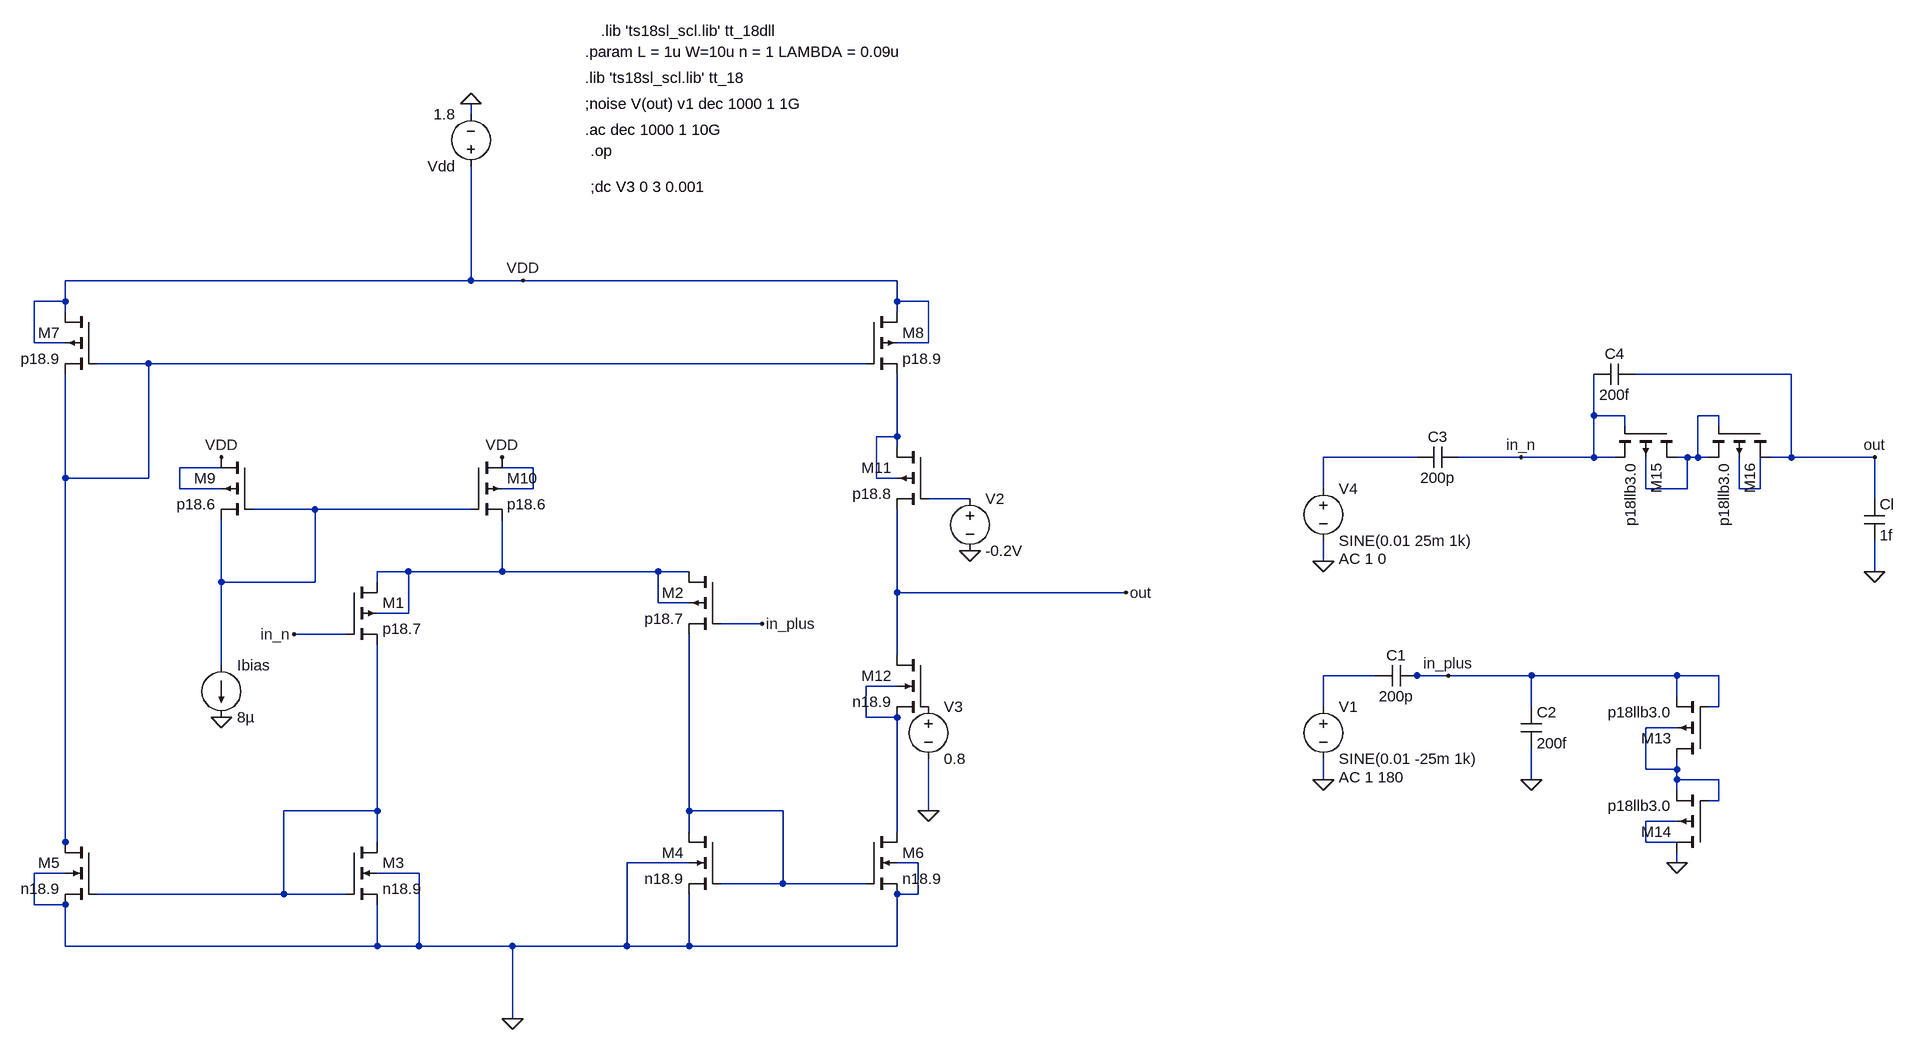
[diagram p0: schematic neural.asc]
neural.asc, the LTspice schematic file:
Version 4
SHEET 1 3032 1344
WIRE 432 -176 432 -192
WIRE 432 80 432 -96
WIRE 432 80 -192 80
WIRE 512 80 432 80
WIRE 1088 80 512 80
WIRE -192 112 -192 80
WIRE -192 112 -240 112
WIRE 1088 112 1088 80
WIRE 1136 112 1088 112
WIRE -192 128 -192 112
WIRE 1088 128 1088 112
WIRE -240 176 -240 112
WIRE -192 176 -240 176
WIRE 1136 176 1136 112
WIRE 1136 176 1088 176
WIRE -64 208 -144 208
WIRE 1040 208 -64 208
WIRE 2464 224 2224 224
WIRE 2160 288 2160 224
WIRE 2208 288 2160 288
WIRE 2352 288 2320 288
WIRE 2208 304 2208 288
WIRE 2352 304 2352 288
WIRE 1088 320 1088 224
WIRE 1088 320 1056 320
WIRE 1088 336 1088 320
WIRE 1888 352 1744 352
WIRE 2048 352 1952 352
WIRE 2160 352 2160 288
WIRE 2160 352 2048 352
WIRE 2192 352 2160 352
WIRE 2304 352 2288 352
WIRE 2320 352 2320 288
WIRE 2320 352 2304 352
WIRE 2336 352 2320 352
WIRE 2464 352 2464 224
WIRE 2464 352 2432 352
WIRE 2592 352 2464 352
WIRE 48 368 -16 368
WIRE 528 368 480 368
WIRE -192 384 -192 224
WIRE -64 384 -64 208
WIRE -64 384 -192 384
WIRE 1056 384 1056 320
WIRE 1088 384 1056 384
WIRE -16 400 -16 368
WIRE 48 400 -16 400
WIRE 528 400 528 368
WIRE 528 400 480 400
WIRE 1744 400 1744 352
WIRE 2240 400 2240 352
WIRE 2304 400 2304 352
WIRE 2304 400 2240 400
WIRE 2384 400 2384 352
WIRE 2416 400 2416 352
WIRE 2416 400 2384 400
WIRE 1200 416 1136 416
WIRE 2592 416 2592 352
WIRE 192 432 96 432
WIRE 432 432 192 432
WIRE 1744 512 1744 480
WIRE 336 528 288 528
WIRE 480 528 480 448
WIRE 480 528 336 528
WIRE 720 528 480 528
WIRE 768 528 720 528
WIRE 2592 528 2592 480
WIRE 48 544 48 448
WIRE 192 544 192 432
WIRE 192 544 48 544
WIRE 288 544 288 528
WIRE 1088 560 1088 432
WIRE 1440 560 1088 560
WIRE 720 576 720 528
WIRE 768 576 720 576
WIRE 336 592 336 528
WIRE 336 592 288 592
WIRE 880 608 816 608
WIRE 240 624 160 624
WIRE 1088 656 1088 560
WIRE 48 672 48 544
WIRE 1824 688 1744 688
WIRE 1888 688 1872 688
WIRE 1936 688 1888 688
WIRE 2064 688 1936 688
WIRE 2288 688 2064 688
WIRE 2352 688 2288 688
WIRE 1088 704 1040 704
WIRE 2288 720 2288 688
WIRE 1744 736 1744 688
WIRE 2064 736 2064 688
WIRE 2352 736 2352 688
WIRE 2352 736 2336 736
WIRE 1040 752 1040 704
WIRE 1088 752 1040 752
WIRE 2288 768 2240 768
WIRE 2240 832 2240 768
WIRE 2288 832 2288 816
WIRE 2288 832 2240 832
WIRE 1744 848 1744 816
WIRE 2064 848 2064 800
WIRE 2288 848 2288 832
WIRE 2352 848 2288 848
WIRE 2288 864 2288 848
WIRE 2352 880 2352 848
WIRE 2352 880 2336 880
WIRE 288 896 288 640
WIRE 288 896 144 896
WIRE 768 896 768 624
WIRE 912 896 768 896
WIRE 1136 896 1136 816
WIRE 2288 912 2240 912
WIRE 768 928 768 896
WIRE 1088 928 1088 752
WIRE -192 944 -192 384
WIRE 288 944 288 896
WIRE 2240 944 2240 912
WIRE 2288 944 2240 944
WIRE -192 960 -192 944
WIRE 768 976 672 976
WIRE 1120 976 1088 976
WIRE 2288 976 2288 960
WIRE -192 992 -240 992
WIRE 352 992 288 992
WIRE 912 1008 912 896
WIRE 912 1008 816 1008
WIRE 1040 1008 912 1008
WIRE 144 1024 144 896
WIRE 144 1024 -144 1024
WIRE 240 1024 144 1024
WIRE 1120 1024 1120 976
WIRE 1120 1024 1088 1024
WIRE -240 1040 -240 992
WIRE -192 1040 -240 1040
WIRE -192 1104 -192 1040
WIRE 288 1104 288 1040
WIRE 288 1104 -192 1104
WIRE 352 1104 352 992
WIRE 352 1104 288 1104
WIRE 496 1104 352 1104
WIRE 672 1104 672 976
WIRE 672 1104 496 1104
WIRE 768 1104 768 1024
WIRE 768 1104 672 1104
WIRE 1088 1104 1088 1024
WIRE 1088 1104 768 1104
WIRE 496 1216 496 1104
FLAG 48 752 0
FLAG 1440 560 out
FLAG 1744 848 0
FLAG 880 608 in_plus
FLAG 1136 896 0
FLAG 1200 496 0
FLAG 496 1216 0
FLAG 512 80 VDD
FLAG 48 352 VDD
FLAG 432 -192 0
FLAG 1744 512 0
FLAG 160 624 in_n
FLAG 2064 848 0
FLAG 2592 528 0
FLAG 2288 976 0
FLAG 480 352 VDD
FLAG 1936 688 in_plus
FLAG 2048 352 in_n
FLAG 2592 352 out
DATAFLAG -192 384 ""
DATAFLAG 512 528 ""
DATAFLAG 912 1008 ""
DATAFLAG 256 1104 ""
DATAFLAG 224 896 ""
DATAFLAG 1088 816 ""
DATAFLAG 1088 528 ""
DATAFLAG 1088 288 ""
SYMBOL nmos4 816 928 M0
SYMATTR InstName M4
SYMATTR Value n18.9
SYMATTR Value2 l=3u w=20u ad={5*W*LAMBDA} as={5*W*LAMBDA} pd={10*LAMBDA+2*W} ps={10*LAMBDA+2*W}
SYMBOL voltage 432 -80 R180
WINDOW 123 24 -12 Left 2
WINDOW 39 0 0 Left 0
SYMATTR InstName Vdd
SYMATTR Value 1.8
SYMBOL pmos4 432 352 R0
SYMATTR InstName M10
SYMATTR Value p18.6
SYMATTR Value2 l=1.2u w=1.2u ad={5*W*LAMBDA} as={5*W*LAMBDA} pd={10*LAMBDA+2*W} ps={10*LAMBDA+2*W}
SYMBOL pmos4 96 352 M0
SYMATTR InstName M9
SYMATTR Value p18.6
SYMATTR Value2 l=1.2u w=1.2u ad={5*W*LAMBDA} as={5*W*LAMBDA} pd={10*LAMBDA+2*W} ps={10*LAMBDA+2*W}
SYMBOL nmos4 240 944 R0
SYMATTR InstName M3
SYMATTR Value n18.9
SYMATTR Value2 l=3u w=20u ad={5*W*LAMBDA} as={5*W*LAMBDA} pd={10*LAMBDA+2*W} ps={10*LAMBDA+2*W}
SYMBOL pmos4 240 544 R0
SYMATTR InstName M1
SYMATTR Value p18.7
SYMATTR Value2 l=180n w=40u ad={5*W*LAMBDA} as={5*W*LAMBDA} pd={10*LAMBDA+2*W} ps={10*LAMBDA+2*W}
SYMBOL pmos4 1040 128 R0
SYMATTR InstName M8
SYMATTR Value p18.9
SYMATTR Value2 l=5u w=100u ad={5*W*LAMBDA} as={5*W*LAMBDA} pd={10*LAMBDA+2*W} ps={10*LAMBDA+2*W}
SYMBOL pmos4 -144 128 M0
SYMATTR InstName M7
SYMATTR Value p18.9
SYMATTR Value2 l=5u w=100u ad={5*W*LAMBDA} as={5*W*LAMBDA} pd={10*LAMBDA+2*W} ps={10*LAMBDA+2*W}
SYMBOL nmos4 -144 944 M0
SYMATTR InstName M5
SYMATTR Value n18.9
SYMATTR Value2 l=3u w=20u ad={5*W*LAMBDA} as={5*W*LAMBDA} pd={10*LAMBDA+2*W} ps={10*LAMBDA+2*W}
SYMBOL nmos4 1040 928 R0
SYMATTR InstName M6
SYMATTR Value n18.9
SYMATTR Value2 l=3u w=20u ad={5*W*LAMBDA} as={5*W*LAMBDA} pd={10*LAMBDA+2*W} ps={10*LAMBDA+2*W}
SYMBOL current 48 672 R0
WINDOW 123 0 0 Left 0
WINDOW 39 0 0 Left 0
SYMATTR InstName Ibias
SYMATTR Value 8µ
SYMBOL pmos4 1136 336 M0
SYMATTR InstName M11
SYMATTR Value p18.8
SYMATTR Value2 l=3.2u w=6.4u ad={5*W*LAMBDA} as={5*W*LAMBDA} pd={10*LAMBDA+2*W} ps={10*LAMBDA+2*W}
SYMBOL nmos4 1136 656 M0
SYMATTR InstName M12
SYMATTR Value n18.9
SYMATTR Value2 l=2u w=40u ad={5*W*LAMBDA} as={5*W*LAMBDA} pd={10*LAMBDA+2*W} ps={10*LAMBDA+2*W}
SYMBOL voltage 1744 720 R0
WINDOW 123 24 124 Left 2
WINDOW 39 0 0 Left 0
SYMATTR Value2 AC 1 180
SYMATTR InstName V1
SYMATTR Value SINE(0.01 -25m 1k)
SYMBOL voltage 1200 400 R0
WINDOW 123 0 0 Left 0
WINDOW 39 0 0 Left 0
SYMATTR InstName V2
SYMATTR Value -0.2V
SYMBOL voltage 1136 720 R0
WINDOW 123 0 0 Left 0
WINDOW 39 0 0 Left 0
SYMATTR InstName V3
SYMATTR Value 0.8
SYMBOL voltage 1744 384 R0
WINDOW 123 24 124 Left 2
WINDOW 39 0 0 Left 0
SYMATTR Value2 AC 1 0
SYMATTR InstName V4
SYMATTR Value SINE(0.01 25m 1k)
SYMBOL cap 1888 672 R90
WINDOW 0 0 32 VBottom 2
WINDOW 3 32 32 VTop 2
SYMATTR InstName C1
SYMATTR Value 200p
SYMBOL cap 1952 336 R90
WINDOW 0 0 32 VBottom 2
WINDOW 3 32 32 VTop 2
SYMATTR InstName C3
SYMATTR Value 200p
SYMBOL cap 2048 736 R0
SYMATTR InstName C2
SYMATTR Value 200f
SYMBOL cap 2224 208 R90
WINDOW 0 0 32 VBottom 2
WINDOW 3 32 32 VTop 2
SYMATTR InstName C4
SYMATTR Value 200f
SYMBOL cap 2576 416 R0
SYMATTR InstName Cl
SYMATTR Value 1f
SYMBOL pmos4 2336 816 R180
SYMATTR InstName M13
SYMATTR Value p18llb3.0
SYMATTR Value2 l=4u w=4u ad=1.8p as=1.8p pd=8.9u ps=8.9u
SYMBOL pmos4 2336 960 R180
SYMATTR InstName M14
SYMATTR Value p18llb3.0
SYMATTR Value2 l=4u w=4u ad=1.8p as=1.8p pd=8.9u ps=8.9u
SYMBOL pmos4 2288 304 R90
SYMATTR InstName M15
SYMATTR Value p18llb3.0
SYMATTR Value2 l=4u w=4u ad=1.8p as=1.8p pd=8.9u ps=8.9u
SYMBOL pmos4 2432 304 R90
SYMATTR InstName M16
SYMATTR Value p18llb3.0
SYMATTR Value2 l=4u w=4u ad=1.8p as=1.8p pd=8.9u ps=8.9u
SYMBOL pmos4 816 528 M0
SYMATTR InstName M2
SYMATTR Value p18.7
SYMATTR Value2 l=180n w=40u ad={5*W*LAMBDA} as={5*W*LAMBDA} pd={10*LAMBDA+2*W} ps={10*LAMBDA+2*W}
TEXT 608 -232 Left 2 !.lib 'ts18sl_scl.lib' tt_18
TEXT 608 -272 Left 2 !.param L = 1u W=10u n = 1 LAMBDA = 0.09u
TEXT 616 -120 Left 2 !.op
TEXT 608 -152 Left 2 !.ac dec 1000 1 10G
TEXT 616 -64 Left 2 !;dc V3 0 3 0.001
TEXT 608 -192 Left 2 !;noise V(out) v1 dec 1000 1 1G
TEXT 632 -304 Left 2 !.lib 'ts18sl_scl.lib' tt_18dll

The netlist it stands for:
* neural.asc
M4 N015 N015 0 0 n18.9 l=3u w=20u ad={5*W*LAMBDA} as={5*W*LAMBDA} pd={10*LAMBDA+2*W} ps={10*LAMBDA+2*W}
Vdd VDD 0 1.8
M10 VDD N009 N010 N006 p18.6 l=1.2u w=1.2u ad={5*W*LAMBDA} as={5*W*LAMBDA} pd={10*LAMBDA+2*W} ps={10*LAMBDA+2*W}
M9 VDD N009 N009 N005 p18.6 l=1.2u w=1.2u ad={5*W*LAMBDA} as={5*W*LAMBDA} pd={10*LAMBDA+2*W} ps={10*LAMBDA+2*W}
M3 N014 N014 0 0 n18.9 l=3u w=20u ad={5*W*LAMBDA} as={5*W*LAMBDA} pd={10*LAMBDA+2*W} ps={10*LAMBDA+2*W}
M1 N010 in_n N014 N010 p18.7 l=180n w=40u ad={5*W*LAMBDA} as={5*W*LAMBDA} pd={10*LAMBDA+2*W} ps={10*LAMBDA+2*W}
M8 VDD N001 N003 VDD p18.9 l=5u w=100u ad={5*W*LAMBDA} as={5*W*LAMBDA} pd={10*LAMBDA+2*W} ps={10*LAMBDA+2*W}
M7 VDD N001 N001 VDD p18.9 l=5u w=100u ad={5*W*LAMBDA} as={5*W*LAMBDA} pd={10*LAMBDA+2*W} ps={10*LAMBDA+2*W}
M5 N001 N014 0 0 n18.9 l=3u w=20u ad={5*W*LAMBDA} as={5*W*LAMBDA} pd={10*LAMBDA+2*W} ps={10*LAMBDA+2*W}
M6 N012 N015 0 0 n18.9 l=3u w=20u ad={5*W*LAMBDA} as={5*W*LAMBDA} pd={10*LAMBDA+2*W} ps={10*LAMBDA+2*W}
Ibias N009 0 8µ
M11 N003 N008 out N003 p18.8 l=3.2u w=6.4u ad={5*W*LAMBDA} as={5*W*LAMBDA} pd={10*LAMBDA+2*W} ps={10*LAMBDA+2*W}
M12 out P001 N012 N012 n18.9 l=2u w=40u ad={5*W*LAMBDA} as={5*W*LAMBDA} pd={10*LAMBDA+2*W} ps={10*LAMBDA+2*W}
V1 N011 0 SINE(0.01 -25m 1k) AC 1 180
V2 N008 0 -0.2V
V3 P001 0 0.8
V4 N004 0 SINE(0.01 25m 1k) AC 1 0
C1 in_plus N011 200p
C3 in_n N004 200p
C2 in_plus 0 200f
C4 out in_n 200f
Cl out 0 1f
M13 N013 in_plus in_plus N013 p18llb3.0 l=4u w=4u ad=1.8p as=1.8p pd=8.9u ps=8.9u
M14 0 N013 N013 N016 p18llb3.0 l=4u w=4u ad=1.8p as=1.8p pd=8.9u ps=8.9u
M15 N002 in_n in_n N002 p18llb3.0 l=4u w=4u ad=1.8p as=1.8p pd=8.9u ps=8.9u
M16 out N002 N002 N007 p18llb3.0 l=4u w=4u ad=1.8p as=1.8p pd=8.9u ps=8.9u
M2 N010 in_plus N015 N010 p18.7 l=180n w=40u ad={5*W*LAMBDA} as={5*W*LAMBDA} pd={10*LAMBDA+2*W} ps={10*LAMBDA+2*W}
.model NMOS NMOS
.model PMOS PMOS
.lib standard.mos
.lib 'ts18sl_scl.lib' tt_18
.param L = 1u W=10u n = 1 LAMBDA = 0.09u
.op
.ac dec 1000 1 10G
;dc V3 0 3 0.001
;noise V(out) v1 dec 1000 1 1G
.lib 'ts18sl_scl.lib' tt_18dll
.backanno
.end